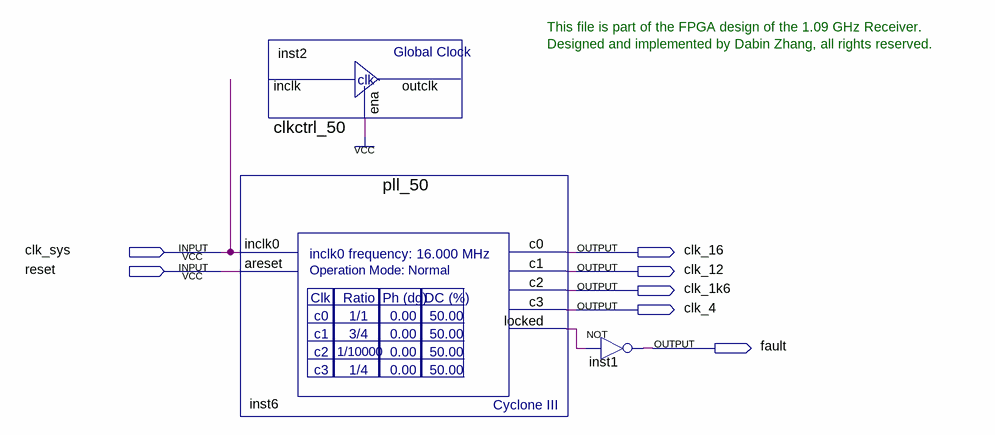
[diagram p0: schematic sheet]
// Quartus schematic clock_unit.bdf as structural Verilog: 3 symbols, 7 pins
module clock_unit (
  input  clk_sys,
  input  reset,
  output clk_16,
  output clk_12,
  output clk_1k6,
  output clk_4,
  output fault
);

  wire inst6_locked;

  pll_50 inst6 (
    .inclk0(clk_sys), .areset(reset), .c0(clk_16), .c1(clk_12), .c2(clk_1k6), .c3(clk_4),
    .locked(inst6_locked));
  clkctrl_50 inst2 (.ena(1'b1));  // open: inclk, outclk
  not inst1 (fault, inst6_locked);

  // Notes on the sheet:
  //   This file is part of the FPGA design of the 1.09 GHz Receiver.
  //   Designed and implemented by Dabin Zhang, all rights reserved.
endmodule
